# Altium schematic sheet 03-2G.SchDoc
size A3
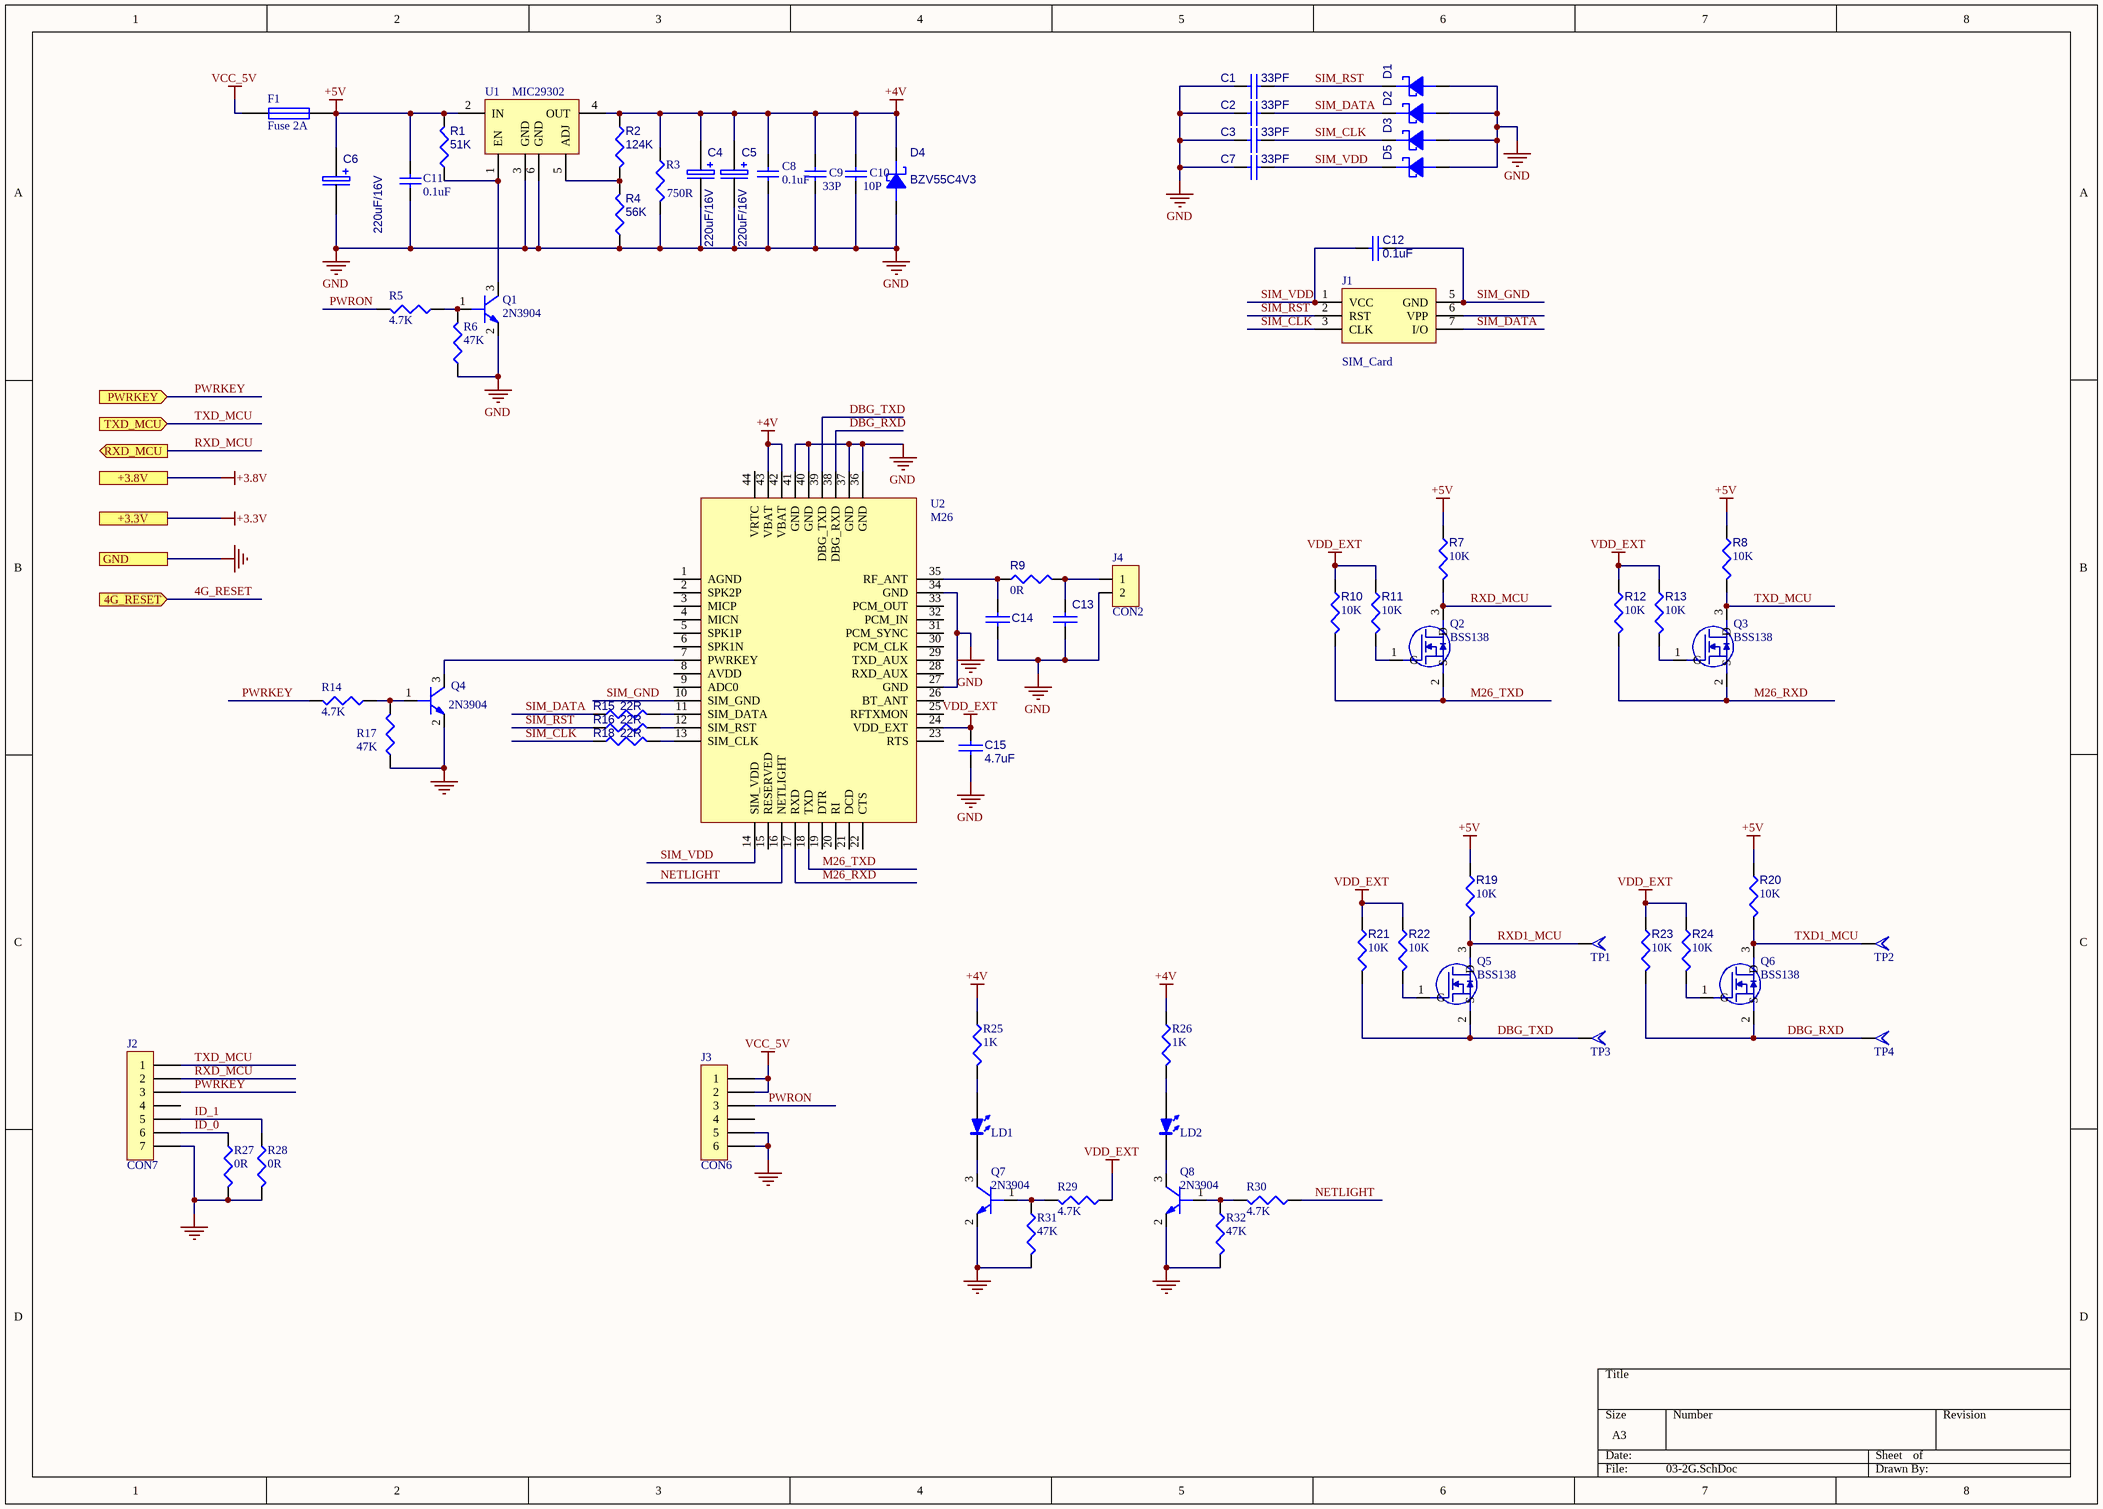
[diagram p0: 03-2G.SchDoc]

## Parts
C1  33PF  [0603_C]
C2  33PF  [0603_C]
C3  33PF  [0603_C]
C4  220uF/16V  [C_TAN_D]
C5  220uF/16V  [C_TAN_D]
C6  220uF/16V  [C_TAN_D]
C7  33PF  [0603_C]
C8  0.1uF  [0603_C]
C9  33P  [0603_C]
C10  10P  [0603_C]
C11  0.1uF  [0603_C]
C12  0.1uF  [0603_C]
C13  NC  [0603_r]  (value not drawn)
C14  NC  [0603_r]  (value not drawn)
C15  4.7uF  [0603_C]
D1  ESD9M5.0ST5G  [SOD-923]  (value not drawn)
D2  ESD9M5.0ST5G  [SOD-923]  (value not drawn)
D3  ESD9M5.0ST5G  [SOD-923]  (value not drawn)
D4  BZV55C4V3  [SOD-80]
D5  ESD9M5.0ST5G  [SOD-923]  (value not drawn)
F1  Fuse 2A  [1812_F]
J1  SIM_Card  [MicroSIM-6]
J2  CON7  [SIP7]
J3  CON6  [SIP6]
J4  CON2  [RF-Z]
LD1  WHITE  [LED_0603]  (value not drawn)
LD2  WHITE  [LED_0603]  (value not drawn)
Q1  2N3904  [SOT23]
Q2  BSS138  [SOT23]
Q3  BSS138  [SOT23]
Q4  2N3904  [SOT23]
Q5  BSS138  [SOT23]
Q6  BSS138  [SOT23]
Q7  2N3904  [SOT23]
Q8  2N3904  [SOT23]
R1  51K  [0603_R]
R2  124K  [0603_R]
R3  750R  [0603_R]
R4  56K  [0603_R]
R5  4.7K  [0603_R]
R6  47K  [0603_R]
R7  10K  [0603_R]
R8  10K  [0603_R]
R9  0R  [0603_R]
R10  10K  [0603_R]
R11  10K  [0603_R]
R12  10K  [0603_R]
R13  10K  [0603_R]
R14  4.7K  [0603_R]
R15  22R  [0603_R]
R16  22R  [0603_R]
R17  47K  [0603_R]
R18  22R  [0603_R]
R19  10K  [0603_R]
R20  10K  [0603_R]
R21  10K  [0603_R]
R22  10K  [0603_R]
R23  10K  [0603_R]
R24  10K  [0603_R]
R25  1K  [0603_R]
R26  1K  [0603_R]
R27  0R  [0603_R]
R28  0R  [0603_R]
R29  4.7K  [0603_R]
R30  4.7K  [0603_R]
R31  47K  [0603_R]
R32  47K  [0603_R]
TP1  Component_1  [TP-40]  (value not drawn)
TP2  Component_1  [TP-40]  (value not drawn)
TP3  Component_1  [TP-40]  (value not drawn)
TP4  Component_1  [TP-40]  (value not drawn)
U1  MIC29302  [TO-263-5]
U2  M26  [M26]

## Ports
4G_RESET, +3.3V, +3.8V, GND, PWRKEY, RXD_MCU, TXD_MCU

## Nets
+3.3V: port +3.3V
+3.8V: port +3.8V
+4V: C4.1(+) C5.1(+) C8.2 C9.2 C10.2 D4.2(CATHODE) R2.2 R3.2 R25.1 R26.1 U1.4(OUT) U2.42(VBAT) U2.43(VBAT)
+5V: C6.1(+) C11.2 F1.2 R1.1 R7.1 R8.1 R19.1 R20.1 U1.2(IN)
GND: C1.1 C2.1 C3.1 C4.2(-) C5.2(-) C6.2(-) C7.1 C8.1 C9.1 C10.1 C11.1 C13.2 C14.2 C15.2 D1.1(ANODE) D2.1(ANODE) D3.1(ANODE) D4.1(ANODE) D5.1(ANODE) J2.7 J3.5 J3.6 J4.2 Q1.2(EMITTER) Q4.2(EMITTER) Q7.2(EMITTER) Q8.2(EMITTER) R3.1 R4.2 R6.2 R17.2 R27.2 R28.2 R31.2 R32.2 U1.3(GND) U1.6(GND) U2.27(GND) U2.34(GND) U2.36(GND) U2.37(GND) U2.40(GND) U2.41(GND) ; port GND
VCC_5V: F1.1 J3.1 J3.2
VDD_EXT: C15.1 R10.1 R11.1 R12.1 R13.1 R21.1 R22.1 R23.1 R24.1 R29.1 U2.24(VDD_EXT)
4G_RESET: port 4G_RESET
DBG_RXD: Q6.2(S) R23.2 TP4.1 U2.38(DBG_RXD)
DBG_TXD: Q5.2(S) R21.2 TP3.1 U2.39(DBG_TXD)
ID_0: J2.6 R27.1
ID_1: J2.5 R28.1
M26_RXD: Q3.2(S) R12.2 U2.17(RXD)
M26_TXD: Q2.2(S) R10.2 U2.18(TXD)
NETLIGHT: R30.1 U2.16(NETLIGHT)
PWRKEY: J2.3 R14.1 ; port PWRKEY
PWRON: J3.3 R5.1
RXD1_MCU: Q5.3(D) R19.2 TP1.1
RXD_MCU: J2.2 Q2.3(D) R7.2 ; port RXD_MCU
SIM_CLK: C3.2 D3.2(CATHODE) J1.3(CLK) R18.1
SIM_DATA: C2.2 D2.2(CATHODE) J1.7(I/O) R15.1
SIM_GND: C12.2 J1.5(GND) U2.10(SIM_GND)
SIM_RST: C1.2 D1.2(CATHODE) J1.2(RST) R16.1
SIM_VDD: C7.2 C12.1 D5.2(CATHODE) J1.1(VCC) U2.14(SIM_VDD)
TXD1_MCU: Q6.3(D) R20.2 TP2.1
TXD_MCU: J2.1 Q3.3(D) R8.2 ; port TXD_MCU
NetC13_1: C13.1 J4.1 R9.2
NetC14_1: C14.1 R9.1 U2.35(RF_ANT)
NetLD1_A: LD1.A R25.2
NetLD1_K: LD1.K Q7.3(COLLECTOR)
NetLD2_A: LD2.A R26.2
NetLD2_K: LD2.K Q8.3(COLLECTOR)
NetQ1_1: Q1.1(BASE) R5.2 R6.1
NetQ1_3: Q1.3(COLLECTOR) R1.2 U1.1(EN)
NetQ2_1: Q2.1(G) R11.2
NetQ3_1: Q3.1(G) R13.2
NetQ4_1: Q4.1(BASE) R14.2 R17.1
NetQ4_3: Q4.3(COLLECTOR) U2.7(PWRKEY)
NetQ5_1: Q5.1(G) R22.2
NetQ6_1: Q6.1(G) R24.2
NetQ7_1: Q7.1(BASE) R29.2 R31.1
NetQ8_1: Q8.1(BASE) R30.2 R32.1
NetR2_1: R2.1 R4.1 U1.5(ADJ)
NetR15_2: R15.2 U2.11(SIM_DATA)
NetR16_2: R16.2 U2.12(SIM_RST)
NetR18_2: R18.2 U2.13(SIM_CLK)

Not connected (* = marked no-connect by the designer): J1 6(VPP); J2 4; J3 4; U2 1(AGND) 2(SPK2P) 3(MICP) 4(MICN) 5(SPK1P) 6(SPK1N) 8(AVDD) 9(ADC0) 15(RESERVED) 19(DTR) 20(RI) 21(DCD) 22(CTS) 23(RTS) 25(RFTXMON) 26(BT_ANT) 28(RXD_AUX) 29(TXD_AUX) 30(PCM_CLK) 31(PCM_SYNC) 32(PCM_IN) 33(PCM_OUT) 44(VRTC)

## Library data of the parts
C1-C3 C7 C12-C15 = CAP
C4-C6 = ECAP: E-CAP
C8-C11 = Cap Semi: Capacitor; Published: 8-Jun-2000; LatestRevisionDate: 29-May-2009; LatestRevisionNote: IPC-7351 Footprint Added.; PackageReference: C1206; Publisher: Altium Limited; PackageDescription: Chip Capacitor
D1-D5 = DIODE SCHOTTKY
F1 = Fuse 1: Fuse; Published: 8-Jun-2000; LatestRevisionDate: 17-Jul-2002; LatestRevisionNote: Re-released for DXP Platform.; PackageReference: PIN-W2/E2.8; Publisher: Altium Limited; PackageDescription: Thru-Hole; 2 Leads
LD1 LD2 = LED
Q1 Q4 Q7 Q8 = NPN
Q2 Q3 Q5 Q6 = N-Channel Enhancement MOSFET
R1 R2 R4 R15 R16 R18 = R0.25W: RESISTOR
R3 R5 R6 R14 R17 R25-R32 = RES1
R7-R13 R19-R24 = Res3_3: Resistor; Published: 8-Jun-2000; LatestRevisionDate: 29-May-2009; LatestRevisionNote: IPC-7351 Footprint Added.; PackageReference: J1-0603; Publisher: Altium Limited; PackageDescription: Chip Resistor